# EasyEDA schematic SCH_HitboxRPI_PICO_2023-08-04.json

## Sheets
1 Sheet_1: TITLE: Hitbox; REV: 1.0; Date: 2023-06-13; Sheet: 1/1; Drawn By: Amado; Company: ADMBuilt
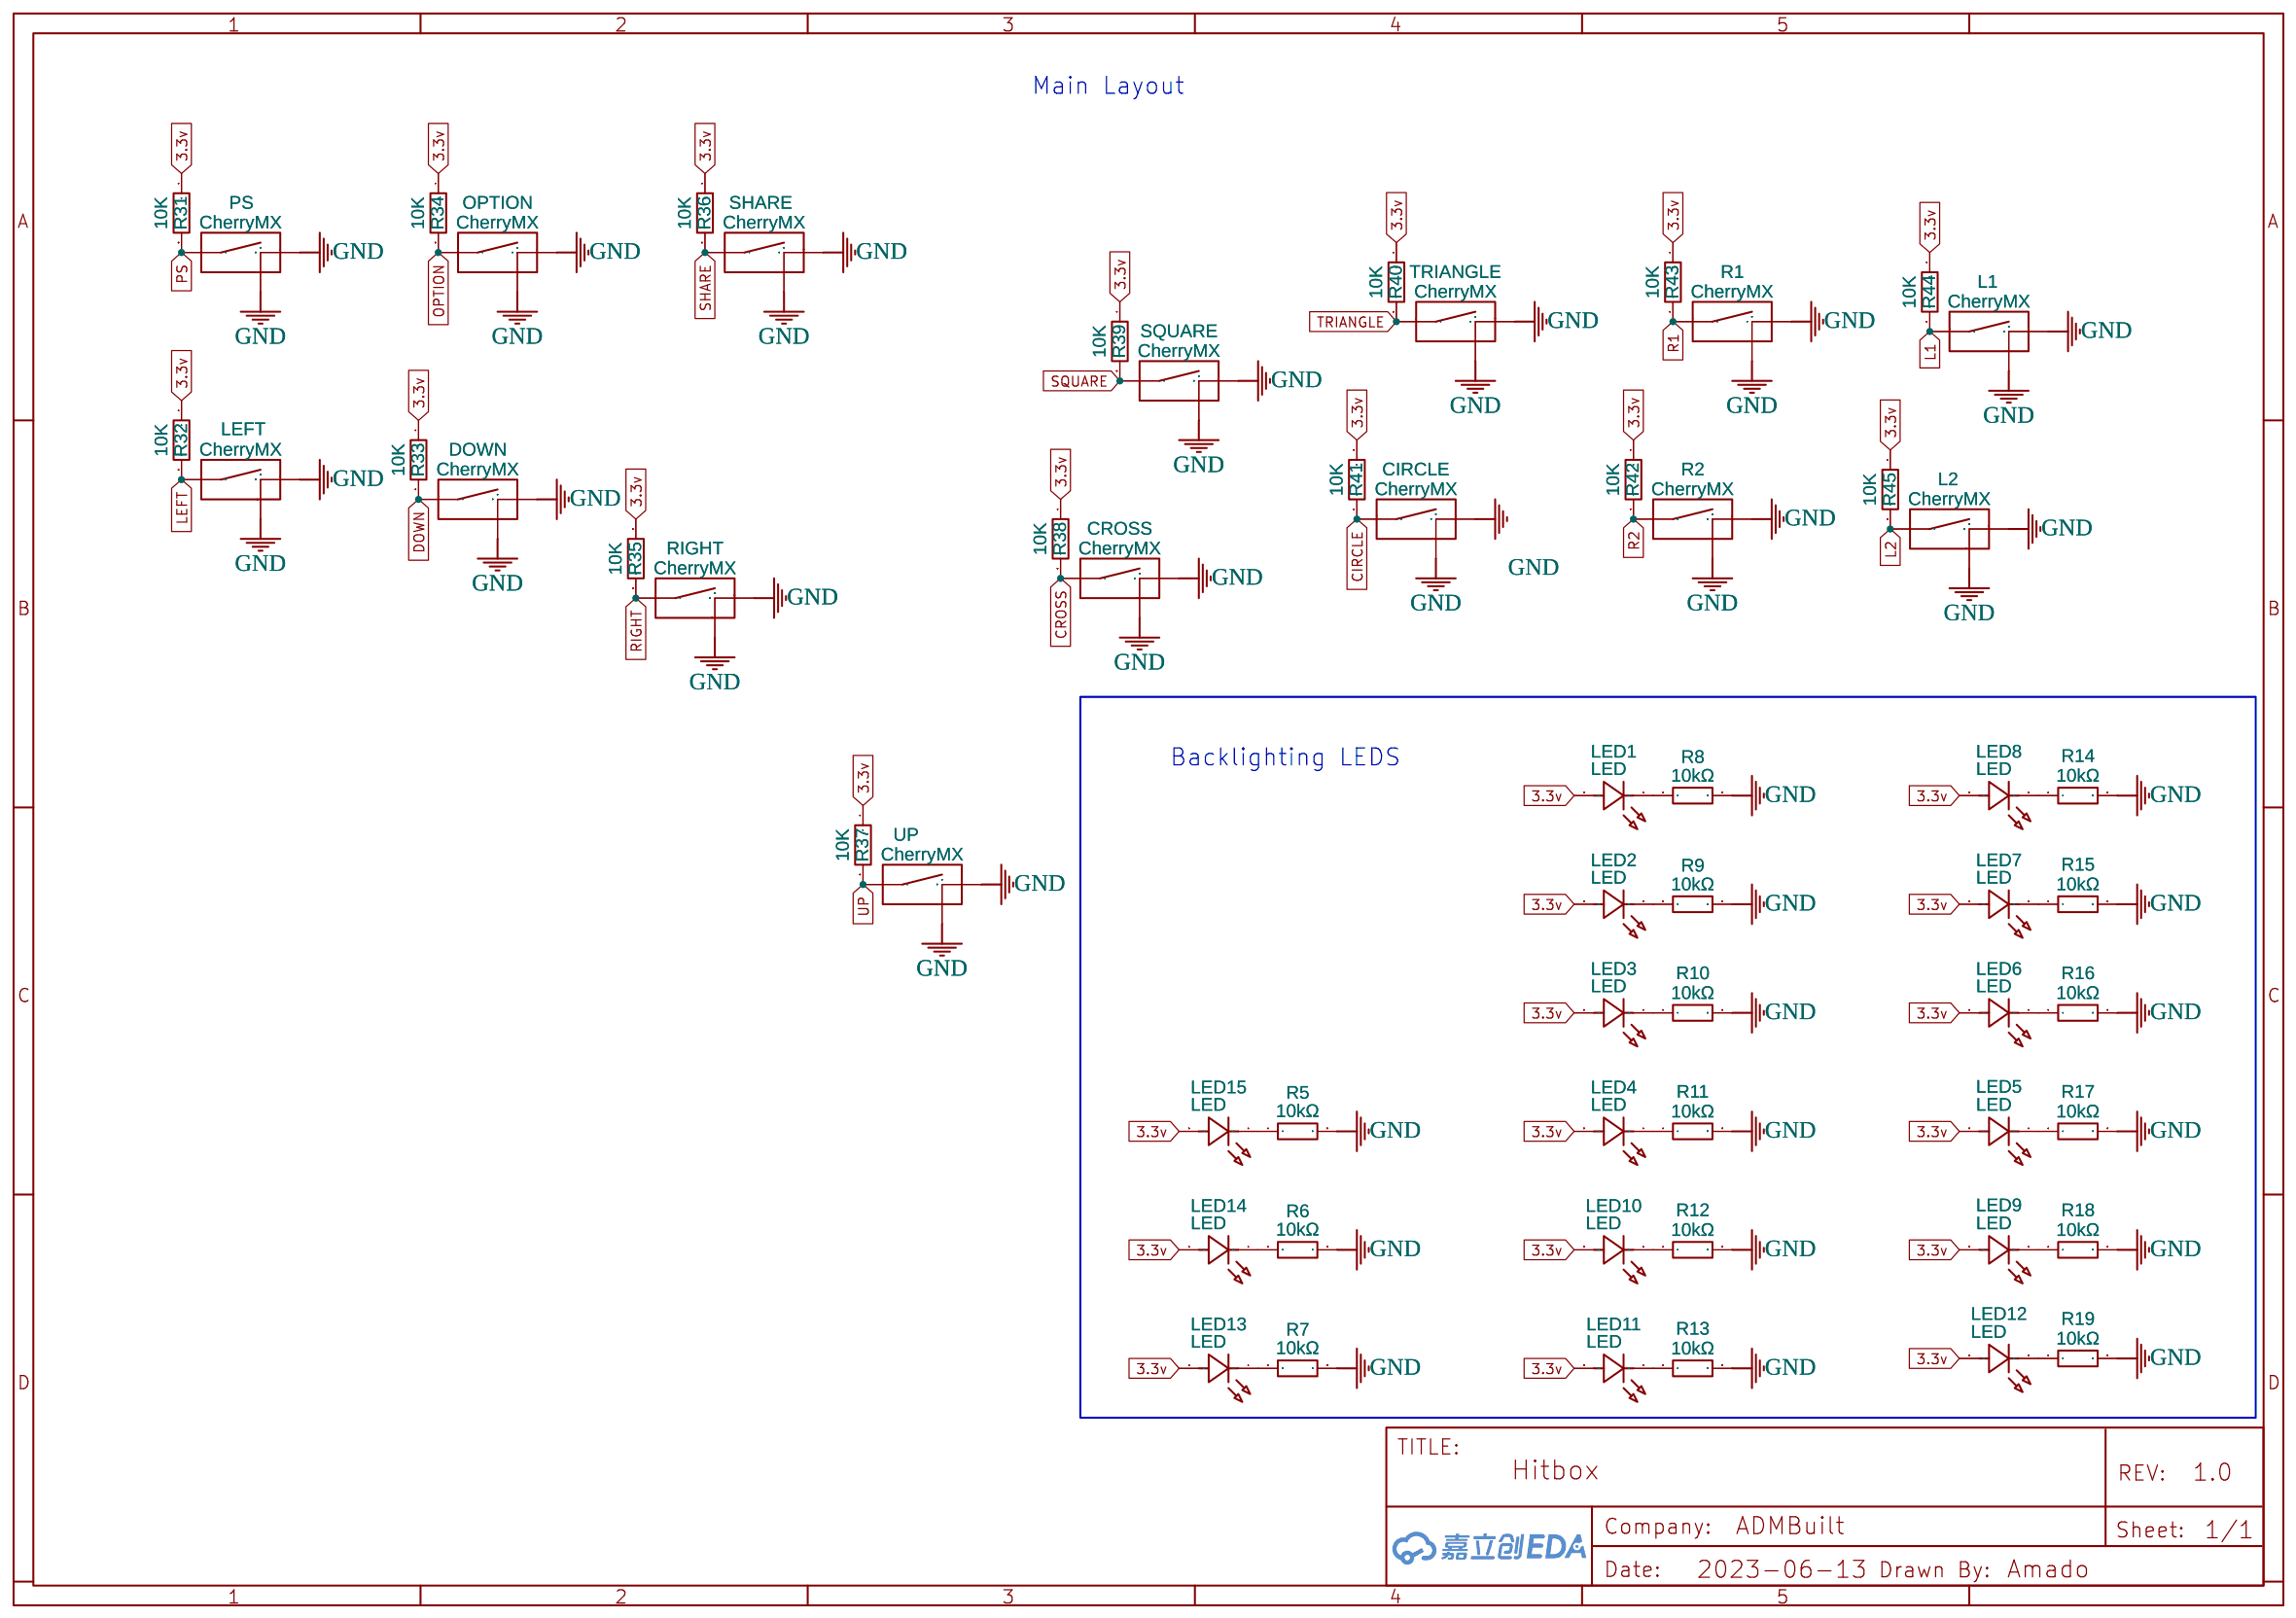
[diagram p0: Sheet_1]
2 Sheet_2: TITLE: Sheet_2; Date: 2023-06-14; Company: Your Company
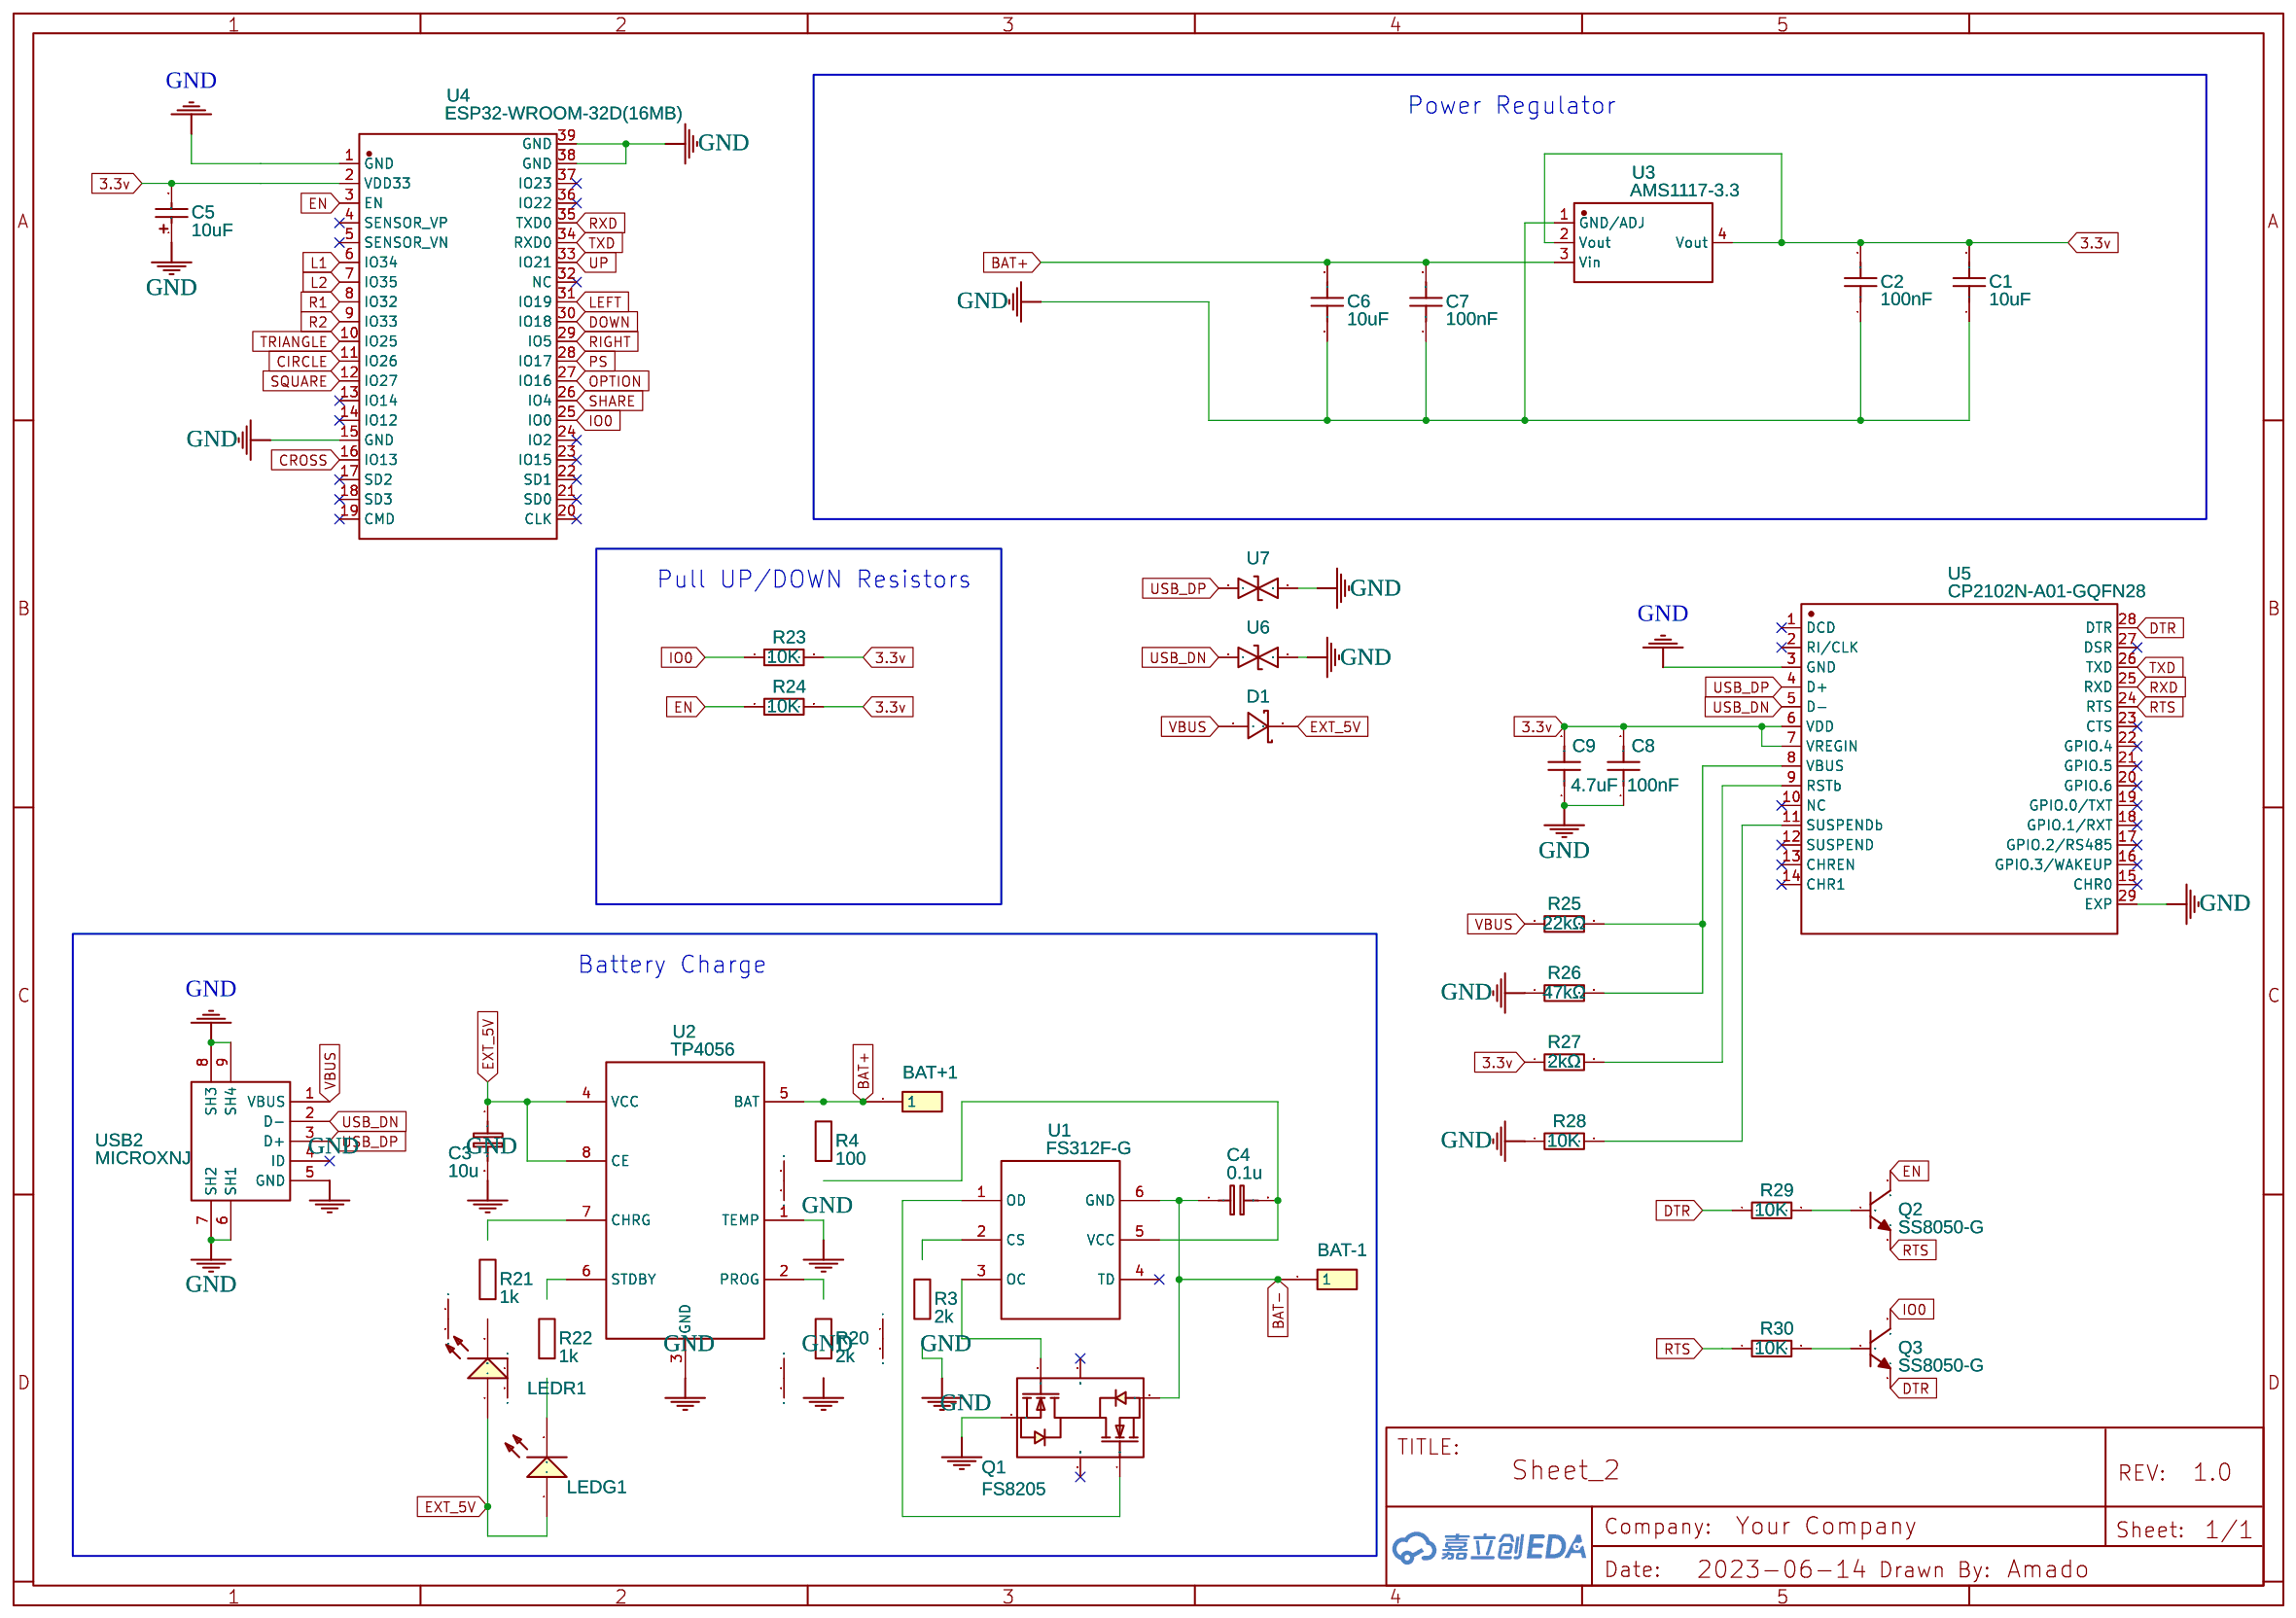
[diagram p1: Sheet_2]

## Parts
sheet Sheet_1
CIRCLE  CherryMX  [CHERRY_MX]
CROSS  CherryMX  [CHERRY_MX]
DOWN  CherryMX  [CHERRY_MX]
L1  CherryMX  [CHERRY_MX]
L2  CherryMX  [CHERRY_MX]
LED1  LED  [LED0603-RD_GREEN]
LED2  LED  [LED0603-RD_GREEN]
LED3  LED  [LED0603-RD_GREEN]
LED4  LED  [LED0603-RD_GREEN]
LED5  LED  [LED0603-RD_GREEN]
LED6  LED  [LED0603-RD_GREEN]
LED7  LED  [LED0603-RD_GREEN]
LED8  LED  [LED0603-RD_GREEN]
LED9  LED  [LED0603-RD_GREEN]
LED10  LED  [LED0603-RD_GREEN]
LED11  LED  [LED0603-RD_GREEN]
LED12  LED  [LED0603-RD_GREEN]
LED13  LED  [LED0603-RD_GREEN]
LED14  LED  [LED0603-RD_GREEN]
LED15  LED  [LED0603-RD_GREEN]
LEFT  CherryMX  [CHERRY_MX]
OPTION  CherryMX  [CHERRY_MX]
PS  CherryMX  [CHERRY_MX]
R1  CherryMX  [CHERRY_MX]
R2  CherryMX  [CHERRY_MX]
R5  10kΩ  [R0402]
R6  10kΩ  [R0402]
R7  10kΩ  [R0402]
R8  10kΩ  [R0402]
R9  10kΩ  [R0402]
R10  10kΩ  [R0402]
R11  10kΩ  [R0402]
R12  10kΩ  [R0402]
R13  10kΩ  [R0402]
R14  10kΩ  [R0402]
R15  10kΩ  [R0402]
R16  10kΩ  [R0402]
R17  10kΩ  [R0402]
R18  10kΩ  [R0402]
R19  10kΩ  [R0402]
R31  10K  [R0603]
R32  10K  [R0603]
R33  10K  [R0603]
R34  10K  [R0603]
R35  10K  [R0603]
R36  10K  [R0603]
R37  10K  [R0603]
R38  10K  [R0603]
R39  10K  [R0603]
R40  10K  [R0603]
R41  10K  [R0603]
R42  10K  [R0603]
R43  10K  [R0603]
R44  10K  [R0603]
R45  10K  [R0603]
RIGHT  CherryMX  [CHERRY_MX]
SHARE  CherryMX  [CHERRY_MX]
SQUARE  CherryMX  [CHERRY_MX]
TRIANGLE  CherryMX  [CHERRY_MX]
UP  CherryMX  [CHERRY_MX]
sheet Sheet_2
BAT+1  BAT+  [HDR-1X1/2.54]
BAT-1  BAT-  [HDR-1X1/2.54]
C1  10uF  [C0603]
C2  100nF  [C0603]
C3  10u  [0603]
C4  0.1u  [0603]
C5  10uF  [CAP-SMD_L3.5-W2.8-R-RD]
C6  10uF  [C0603]
C7  100nF  [C0603]
C8  100nF  [C0603]
C9  4.7uF  [C0603]
D1  BAT760-7  [SOD-323_L1.8-W1.3-LS2.5-RD]
LEDG1  19-217/GHC-YR1S2/3T  [LED-0603]
LEDR1  Red(0603)  [LED-0603]
Q1  FS8205  [SOT-23-6]
Q2  SS8050-G  [SOT-23-3_L2.9-W1.6-P1.90-LS2.8-BR]
Q3  SS8050-G  [SOT-23-3_L2.9-W1.6-P1.90-LS2.8-BR]
R3  2k  [0603]
R4  100  [0603]
R20  2k  [0603]
R21  1k  [0603]
R22  1k  [0603]
R23  10K  [R0603]
R24  10K  [R0603]
R25  22kΩ  [R0603]
R26  47kΩ  [R0603]
R27  2kΩ  [R0603]
R28  10K  [R0603]
R29  10K  [R0603]
R30  10K  [R0603]
U1  FS312F-G  [SOT-23-6]
U2  TP4056  [SOP-8_EP_150MIL]
U3  AMS1117-3.3  [SOT-223-3_L6.5-W3.4-P2.30-LS7.0-BR]
U4  ESP32-WROOM-32D(16MB)  [WIFIM-SMD_39P-L25.5-W18.0-P1.27-BL]
U5  CP2102N-A01-GQFN28  [QFN-28_L5.0-W5.0-P0.50-BL-EP3.3]
U6  LESD5D5.0CT1G-ES  [SOD-523_L1.2-W0.8-LS1.6-BI]
U7  LESD5D5.0CT1G-ES  [SOD-523_L1.2-W0.8-LS1.6-BI]
USB2  MICROXNJ  [MICRO-USB-SMD_MICROXNJ]

## Library data of the parts
CIRCLE CROSS DOWN L1 L2 LEFT OPTION PS R1 R2 RIGHT SHARE SQUARE TRIANGLE UP = Cherry_mx_low_profile_MIRRORED: Contributor: Amado
LED1-LED15 = EL0603/GHC-C01/DT: Supplier: LCSC; Supplier Part: C883164; Manufacturer: EVERLIGHT(亿光); Contributor: LCSC
R5-R19 = 0402WGF1002TCE: Supplier: LCSC; Manufacturer: UNI-ROYAL(厚声); Supplier Part: C25744; Resistance (Ohms): 10K; JLCPCB Part Class: Basic Part
R23 R24 R28-R45 = 0603WAF1002T5E: Supplier: LCSC; Manufacturer: UniOhm; Supplier Part: C25804; JLCPCB Part Class: Basic Part
BAT+1 BAT-1 = -: Supplier: LCSC; Manufacturer: LCSC; Manufacturer Part: Header-Male-2.54_1x1; Supplier Part: C81276
C1 C6 = CL10A106KP8NNNC: Supplier: LCSC; Manufacturer: SAMSUNG; Supplier Part: C19702; JLCPCB Part Class: Basic Part
C2 C7 C8 = CC0603KRX7R9BB104: Supplier: LCSC; Manufacturer: YAGEO; Supplier Part: C14663; JLCPCB Part Class: Basic Part
C3 C4 = Capacitor: Manufacturer Part: ?
C5 = CA45-B-16V-10UF-K: Supplier: LCSC; Manufacturer: CEC; Manufacturer Part: CA45-B-16V-10uF-K; Contributor: LCSC; Supplier Part: C128257; JLCPCB Part Class: Extended Part
C9 = CC0603KRX5R8BB475: Supplier: LCSC; Supplier Part: C326580; Manufacturer: YAGEO(国巨); Contributor: LCSC; JLCPCB Part Class: Extended Part
D1 = BAT760-7: Supplier: LCSC; Manufacturer: DIODES(美台); Contributor: LCSC; Supplier Part: C124187; JLCPCB Part Class: Extended Part
LEDG1 = -: Supplier: LCSC; Manufacturer: EVERLIGHT; Supplier Part: C72043
LEDR1 = -: Supplier: LCSC; Manufacturer: LCSC; Manufacturer Part: KT-0603R; Supplier Part: C2286
Q1 = -: Supplier: LCSC; Manufacturer: FORTUNE; Supplier Part: C32254
Q2 Q3 = SS8050-G: Supplier: LCSC; Manufacturer: CJ(江苏长电/长晶); Contributor: LCSC; Supplier Part: C164886; JLCPCB Part Class: Extended Part
R3 R4 R20-R22 = Resistor: Manufacturer Part: ?
R25 = 0603WAF2202T5E: Supplier: LCSC; Manufacturer: UNI-ROYAL(厚声); Supplier Part: C31850; Resistance (Ohms): 22K; JLCPCB Part Class: Basic Part
R26 = 0603WAF4702T5E: Supplier: LCSC; Manufacturer: UNI-ROYAL(厚声); Supplier Part: C25819; Resistance (Ohms): 47K; JLCPCB Part Class: Basic Part
R27 = 0603WAF2001T5E: Supplier: LCSC; Manufacturer: UNI-ROYAL(厚声); Supplier Part: C22975; Resistance (Ohms): 2K; JLCPCB Part Class: Basic Part
U1 = -: Supplier: LCSC; Manufacturer: FORTUNE; Manufacturer Part: DW01+G; Supplier Part: C14213
U2 = -: Contributor: Guest; Supplier: LCSC; Manufacturer: TOPPOWER; Supplier Part: C16581
U3 = AMS1117-3.3: sourceId: dwIGgezVh; Supplier: LCSC; Manufacturer: AMS; Supplier Part: C6186; JLCPCB Part Class: Basic Part
U4 = ESP32-WROOM-32D(16MB): Supplier: LCSC; Supplier Part: C529578; Manufacturer: Espressif Systems; Contributor: LCSC; JLCPCB Part Class: Extended Part
U5 = CP2102N-A01-GQFN28: Supplier: LCSC; Manufacturer: SILICON LABS(芯科); Manufacturer Part: CP2102N-A01-GQFN28R; Contributor: LCSC; Supplier Part: C105167; JLCPCB Part Class: Extended Part
U6 U7 = LESD5D5.0CT1G-ES: Supplier: LCSC; Supplier Part: C5199159; Manufacturer: ElecSuper(静芯微）; link: https://atta.szlcsc.com/upload/public/pdf/source/20221017/96E2AF854A53C2861EAE09568B159815.pdf; Contributor: lcsc
USB2 = MICROXNJ: Supplier: LCSC; Supplier Part: C404969; Manufacturer: SHOU HAN; Manufacturer Part: MicroXNJ; Contributor: LCSC; JLCPCB Part Class: Extended Part

## Nets
3.3v: C1.2 C2.2 C5.2 C8.2 C9.2 LED1.2(A) LED2.2(A) LED3.2(A) LED4.2(A) LED5.2(A) LED6.2(A) LED7.2(A) LED8.2(A) LED9.2(A) LED10.2(A) LED11.2(A) LED12.2(A) LED13.2(A) LED14.2(A) LED15.2(A) R23.2 R24.2 R27.1 R31.1 R32.1 R33.1 R34.1 R35.1 R36.1 R37.1 R38.1 R39.1 R40.1 R41.1 R42.1 R43.1 R44.1 R45.1 U3.2(Vout) U3.4(Vout) U4.2(VDD33) U5.6(VDD) U5.7(VREGIN)
GND: C1.1 C2.1 C3.2 C5.1 C6.1 C7.1 C8.1 C9.1 CIRCLE.2 CIRCLE.3 CROSS.2 CROSS.3 DOWN.2 DOWN.3 L1.2 L1.3 L2.2 L2.3 LEFT.2 LEFT.3 OPTION.2 OPTION.3 PS.2 PS.3 Q1.1(S1) R1.2 R1.3 R2.2 R2.3 R3.1 R5.2 R6.2 R7.2 R8.2 R9.2 R10.2 R11.2 R12.2 R13.2 R14.2 R15.2 R16.2 R17.2 R18.2 R19.2 R20.1 R26.1 R28.1 RIGHT.2 RIGHT.3 SHARE.2 SHARE.3 SQUARE.2 SQUARE.3 TRIANGLE.2 TRIANGLE.3 U2.1(TEMP) U2.3(GND) U3.1(GND/ADJ) U4.1(GND) U4.15(GND) U4.38(GND) U4.39(GND) U5.3(GND) U5.29(EXP) U6.1 U7.1 UP.2 UP.3 USB2.5(GND) USB2.6(SH1) USB2.7(SH2) USB2.8(SH3) USB2.9(SH4)
VBUS: D1.2 R25.1 USB2.1(VBUS)
BAT+: BAT+1.1 C6.2 C7.2 R4.2 U2.5(BAT) U3.3(Vin)
BAT-: BAT-1.1 C4.1 Q1.3(S2) U1.6(GND)
CIRCLE: CIRCLE.1 R41.2 U4.11(IO26)
CROSS: CROSS.1 R38.2 U4.16(IO13)
DOWN: DOWN.1 R33.2 U4.30(IO18)
DTR: Q3.2(E) R29.1 U5.28(DTR)
EN: Q2.3(C) R24.1 U4.3(EN)
EXT_5V: C3.1 D1.1 LEDG1.1(A) LEDR1.1(A) U2.4(VCC) U2.8(CE)
IO0: Q3.3(C) R23.1 U4.25(IO0)
L1: L1.1 R44.2 U4.6(IO34)
L2: L2.1 R45.2 U4.7(IO35)
LEFT: LEFT.1 R32.2 U4.31(IO19)
OPTION: OPTION.1 R34.2 U4.27(IO16)
PS: PS.1 R31.2 U4.28(IO17)
R1: R1.1 R43.2 U4.8(IO32)
R2: R2.1 R42.2 U4.9(IO33)
RIGHT: R35.2 RIGHT.1 U4.29(IO5)
RTS: Q2.2(E) R30.1 U5.24(RTS)
RXD: U4.35(TXD0) U5.25(RXD)
SHARE: R36.2 SHARE.1 U4.26(IO4)
SQUARE: R39.2 SQUARE.1 U4.12(IO27)
TRIANGLE: R40.2 TRIANGLE.1 U4.10(IO25)
TXD: U4.34(RXD0) U5.26(TXD)
UP: R37.2 U4.33(IO21) UP.1
USB_DN: U5.5(D-) U6.2 USB2.2(D-)
USB_DP: U5.4(D+) U7.2 USB2.3(D+)
Net-(C4-2): C4.2 R4.1 U1.5(VCC)
Net-(LED1-1): LED1.1(K) R8.1
Net-(LED2-1): LED2.1(K) R9.1
Net-(LED3-1): LED3.1(K) R10.1
Net-(LED4-1): LED4.1(K) R11.1
Net-(LED5-1): LED5.1(K) R17.1
Net-(LED6-1): LED6.1(K) R16.1
Net-(LED7-1): LED7.1(K) R15.1
Net-(LED8-1): LED8.1(K) R14.1
Net-(LED9-1): LED9.1(K) R18.1
Net-(LED10-1): LED10.1(K) R12.1
Net-(LED11-1): LED11.1(K) R13.1
Net-(LED12-1): LED12.1(K) R19.1
Net-(LED13-1): LED13.1(K) R7.1
Net-(LED14-1): LED14.1(K) R6.1
Net-(LED15-1): LED15.1(K) R5.1
Net-(LEDG1-2): LEDG1.2(C) R22.1
Net-(LEDR1-2): LEDR1.2(C) R21.1
Net-(Q1-4): Q1.4(G2) U1.1(OD)
Net-(Q1-6): Q1.6(G1) U1.3(OC)
Net-(Q2-1): Q2.1(B) R29.2
Net-(Q3-1): Q3.1(B) R30.2
Net-(R3-2): R3.2 U1.2(CS)
Net-(R20-2): R20.2 U2.2(PROG)
Net-(R21-2): R21.2 U2.7(CHRG)
Net-(R22-2): R22.2 U2.6(STDBY)
Net-(R25-2): R25.2 R26.2 U5.8(VBUS)
Net-(R27-2): R27.2 U5.9(RSTb)
Net-(R28-2): R28.2 U5.11(SUSPENDb)

Not connected (* = marked no-connect by the designer): Q1 2(D12)* 5(D12)*; U1 4(TD)*; U4 4(SENSOR_VP)* 5(SENSOR_VN)* 13(IO14)* 14(IO12)* 17(SD2)* 18(SD3)* 19(CMD)* 20(CLK)* 21(SD0)* 22(SD1)* 23(IO15)* 24(IO2)* 32(NC)* 36(IO22)* 37(IO23)*; U5 1(DCD)* 2(RI/CLK)* 10(NC)* 12(SUSPEND)* 13(CHREN)* 14(CHR1)* 15(CHR0)* 16(GPIO.3/WAKEUP)* 17(GPIO.2/RS485)* 18(GPIO.1/RXT)* 19(GPIO.0/TXT)* 20(GPIO.6)* 21(GPIO.5)* 22(GPIO.4)* 23(CTS)* 27(DSR)*; USB2 4(ID)*

## Notes on the sheets
sheet 1
- Main Layout
- Backlighting LEDS
sheet 2
- Power Regulator
- Pull UP/DOWN Resistors
- Battery Charge
